# EAGLE schematic MAPLE-CUN-V017-routed (EAGLE 7.3.0)
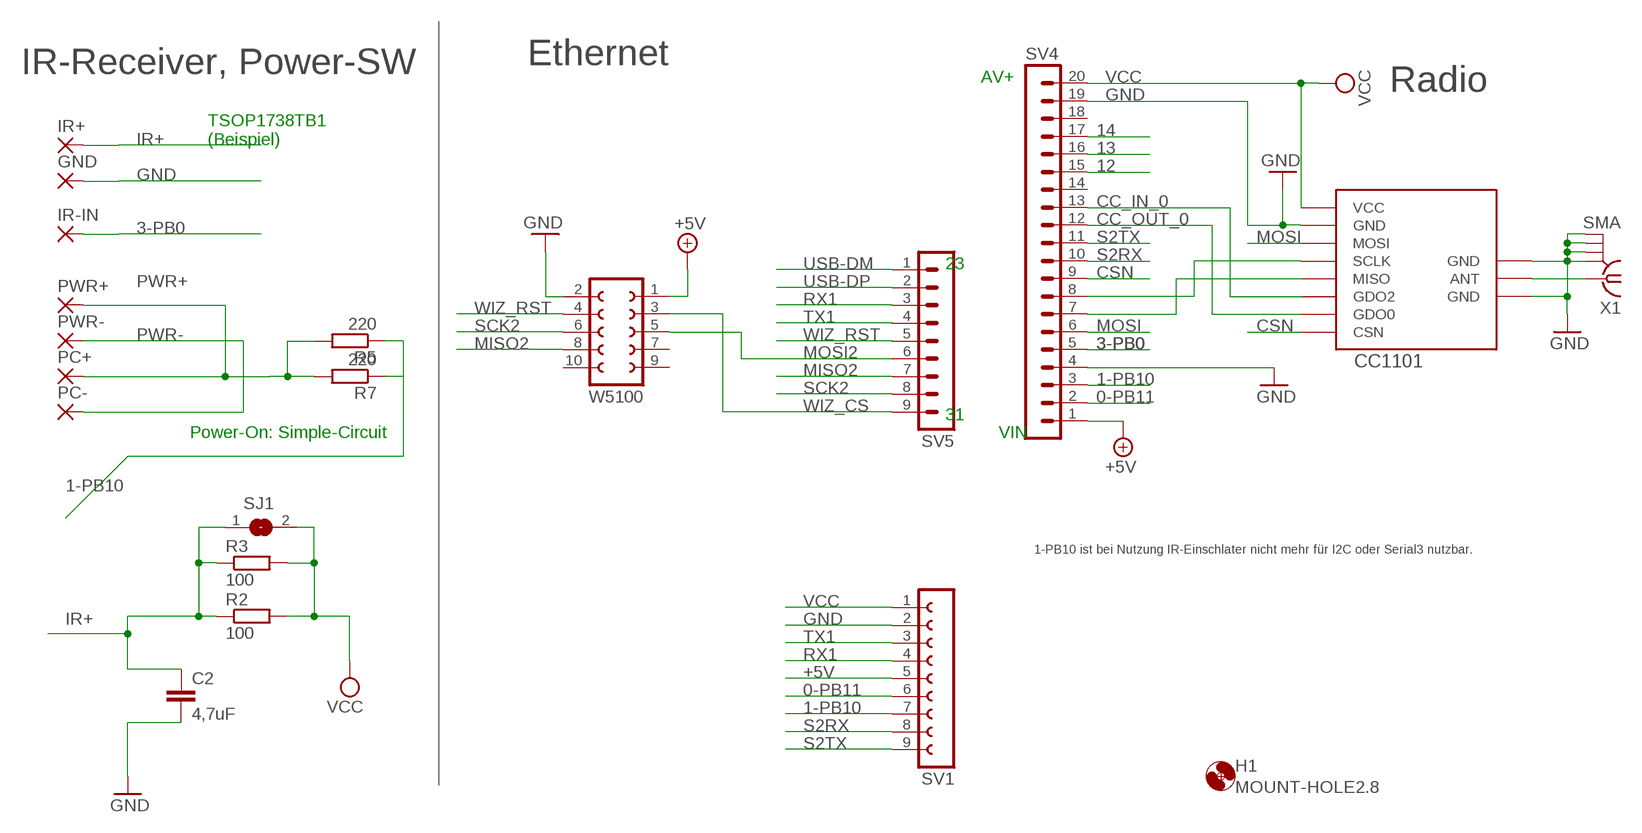
[diagram p0: schematic, sheet 1]

## Parts
C2  4,7uF  C-EUC1206K  [C1206K]
CC1101  CC1101_MODULE1SMD  [CC1101_MODULE1_SMD]
GND  SMD2  [SMD1,27-2,54]
H1  MOUNT-HOLE2.8  [2,8]
IR+  SMD2  [SMD1,27-2,54]
IR-IN  SMD2  [SMD1,27-2,54]
PC+  SMD2  [SMD1,27-2,54]
PC-  SMD2  [SMD1,27-2,54]
PWR+  SMD2  [SMD1,27-2,54]
PWR-  SMD2  [SMD1,27-2,54]
R2  100  R-EU_0204/7  [0204/7]
R3  100  R-EU_R0805W  [R0805W]
R5  220  R-EU_0204/7  [0204/7]
R7  220  R-EU_R0805W  [R0805W]
SJ1  SJ  [SJ]
SV1  FE09-1  [FE09]
SV4  MA20-1  [MA20-1]
SV5  MA09-1  [MA09-1]
W5100  FE05-2  [FE05-2]
X1  SMA  [SMA]

## Nets
0-PB11: SV1.6 SV4.2
1-PB10: R5.1 R7.1 SV1.7 SV4.3
3-PB0: IR-IN.1(P) SV4.5
12: SV4.15
13: SV4.16
14: SV4.17
+5V: SV1.5 SV4.1 W5100.1
CC_IN_0: CC1101.GDO2 SV4.13
CC_OUT_0: CC1101.GDO0 SV4.12
CSN: CC1101.CSN SV4.9
GND: C2.2 CC1101.GND@0(GND) CC1101.GND@1(GND) CC1101.GND@2(GND) GND.1(P) SV1.2 SV4.4 SV4.19 W5100.2 X1.GND@1 X1.GND@2 X1.GND@3 X1.GND@4
IR+: C2.1 IR+.1(P) R2.1 R3.1 SJ1.1
MISO2: SV5.7 W5100.8
MOSI: CC1101.MOSI SV4.6
MOSI2: SV5.6 W5100.5
N$1: CC1101.ANT X1.1
N$3: CC1101.MISO SV4.7
N$4: CC1101.SCLK SV4.8
PWR+: PC+.1(P) PWR+.1(P) R5.2 R7.2
PWR-: PC-.1(P) PWR-.1(P)
RX1: SV1.4 SV5.3
S2RX: SV1.8 SV4.10
S2TX: SV1.9 SV4.11
SCK2: SV5.8 W5100.6
TX1: SV1.3 SV5.4
USB-DM: SV5.1
USB-DP: SV5.2
VCC [PWR]: CC1101.VCC R2.2 R3.2 SJ1.2 SV1.1 SV4.20
WIZ_CS: SV5.9 W5100.3
WIZ_RST: SV5.5 W5100.4
Unconnected: SV4.14 SV4.18 W5100.7 W5100.9 W5100.10

## Notes on the sheet
- IR-Receiver, Power-SW | Ethernet
- AV+
- Radio
- TSOP1738TB1
  (Beispiel)
- 23
- 31
- Power-On: Simple-Circuit | VIN
- 1-PB10 ist bei Nutzung IR-Einschlater nicht mehr für I2C oder Serial3 nutzbar.

## Library data of the parts
C2 = rcl:C-EU: CAPACITOR, European symbol
CC1101 = wireless:CC1101_MODULE1: CC1101 wireless module for 433/868 MHz (sold from Aliexpress). DIL version for mounting with pin header (and SMD soldering) and SMD only variant available.
GND IR+ IR-IN PC+ PC- PWR+ PWR- = wirepad:SMD2: SMD PAD
H1 = holes:MOUNT-HOLE: MOUNTING HOLE with drill center marker
R2 R3 R5 R7 = rcl:R-EU_: RESISTOR, European symbol
SJ1 = jumper:SJ: SMD solder JUMPER
SV1 = con-lsta:FE09-1: FEMALE HEADER; OC_FARNELL: unknown; OC_NEWARK: unknown
SV4 = con-lstb:MA20-1: PIN HEADER; OC_FARNELL: unknown; OC_NEWARK: unknown
SV5 = con-lstb:MA09-1: PIN HEADER; OC_FARNELL: unknown; OC_NEWARK: unknown
W5100 = con-lsta:FE05-2: FEMALE HEADER; OC_FARNELL: unknown; OC_NEWARK: unknown
X1 = sma:SMA: SMA 50 Ohm end launch jack receptacle - round contact

## Net classes
0 default: width 0.406 mm
1 PWR: width 0.61 mm